# EAGLE design heatingHeader (EAGLE 6.3)
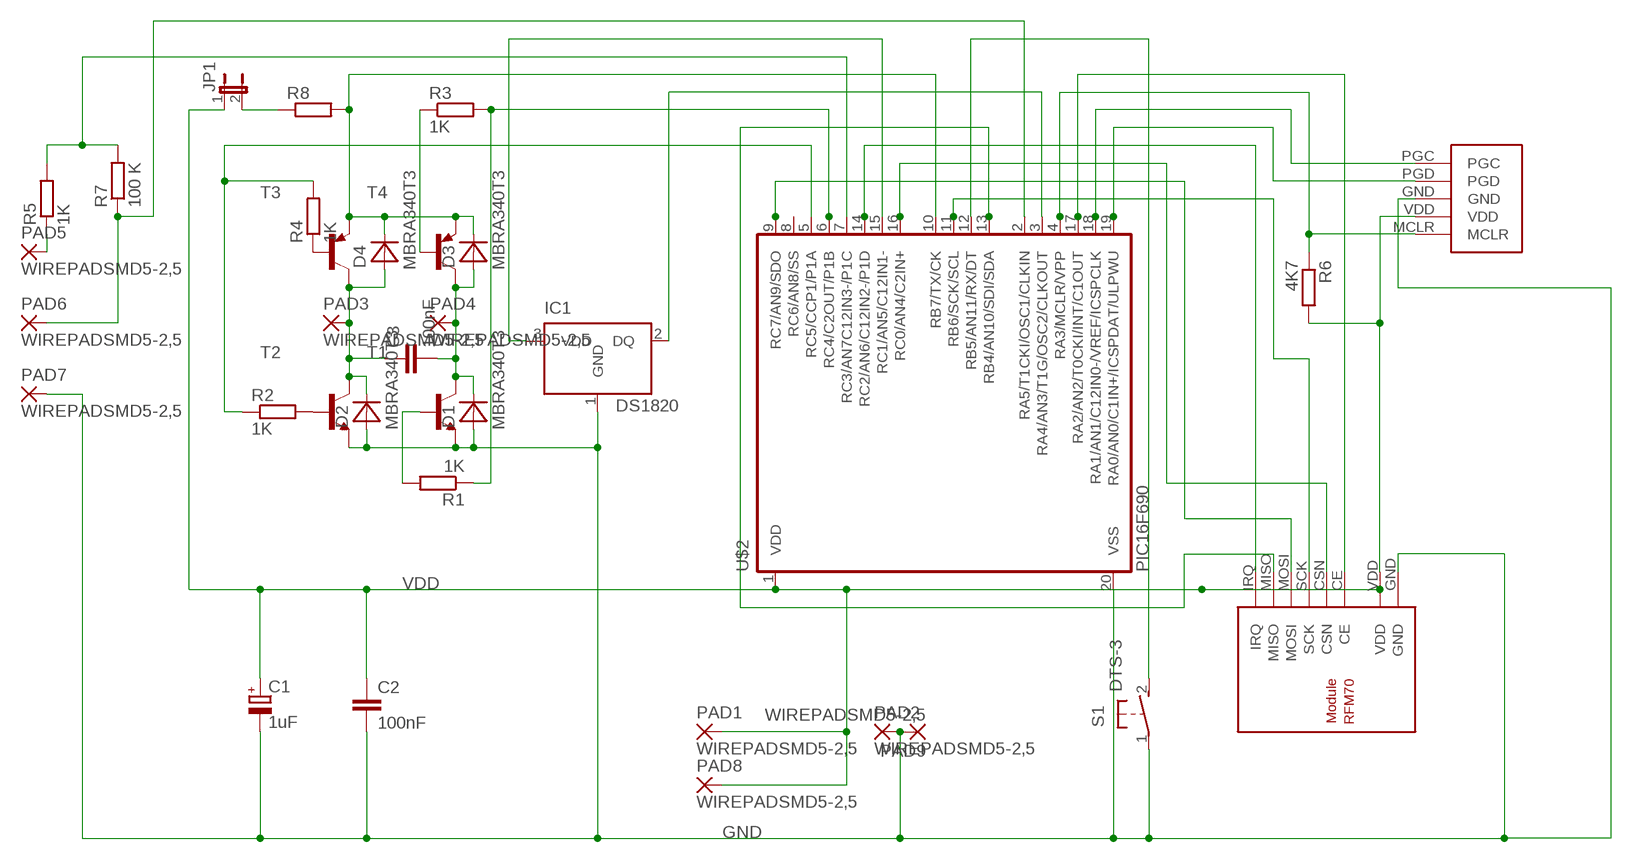
[diagram p0: schematic, sheet 1]

## Parts
C1  1uF  CPOL-EUSMCA  [SMC_A]
C2  100nF  C-EUC2012  [C2012]
C3  100nF  C-EUC2012  [C2012]
D1  MBRA340T3  [SMA]
D2  MBRA340T3  [SMA]
D3  MBRA340T3  [SMA]
D4  MBRA340T3  [SMA]
IC1  DS1820  [TO-92]
JP1  JP1E  [JP1]
PAD1  WIREPADSMD5-2,5  [5-2,5]
PAD2  WIREPADSMD5-2,5  [5-2,5]
PAD3  WIREPADSMD5-2,5  [5-2,5]
PAD4  WIREPADSMD5-2,5  [5-2,5]
PAD5  WIREPADSMD5-2,5  [5-2,5]
PAD6  WIREPADSMD5-2,5  [5-2,5]
PAD7  WIREPADSMD5-2,5  [5-2,5]
PAD8  WIREPADSMD5-2,5  [5-2,5]
PAD9  WIREPADSMD5-2,5  [5-2,5]
R1  1K  R-EU_R1206  [R1206]
R2  1K  R-EU_R1206  [R1206]
R3  1K  R-EU_R1206  [R1206]
R4  1K  R-EU_R1206  [R1206]
R5  1K  R-EU_R1206  [R1206]
R6  4K7  R-EU_R1206W  [R1206W]
R7  100 K  R-EU_R1206  [R1206]
R8  R-EU_R2512W  [R2512W]
S1  DTS-3  [DTS-3]
T1  BC817-40-NPN-SOT23-BEC  [SOT23-BEC]
T2  BC817-40-NPN-SOT23-BEC  [SOT23-BEC]
T3  BC807-16-PNP-SOT23-BEC  [SOT23-BEC]
T4  BC807-16-PNP-SOT23-BEC  [SOT23-BEC]
U$1  RFM70  [RFM70]
U$2  PIC16F690  [SSOP20]
U$3  PROGRAMMINGHEADERDIP  [PROGHEADER]

## Nets
GND: C1.- C2.2 D1.A D2.A IC1.1(GND) PAD2.1(P) PAD7.1(P) PAD9.1(P) S1.1 T1.E T2.E U$1.GND U$2.20(VSS) U$3.GND
N$1: IC1.2(DQ) U$2.3(RA4/AN3/T1G/OSC2/CLKOUT)
N$2: JP1.2 R8.1
N$3: IC1.3(VDD) U$2.15(RC1/AN5/C12IN1-)
N$4: PAD5.1(P) R5.1
N$6: U$1.MISO U$2.13(RB4/AN10/SDI/SDA)
N$7: C3.1 D2.C D4.A PAD3.1(P) T2.C T3.C
N$8: C3.2 D1.C D3.A PAD4.1(P) T1.C T4.C
N$9: PAD6.1(P) R7.1 U$2.2(RA5/T1CKI/OSC1/CLKIN)
N$10: S1.2 U$2.12(RB5/AN11/RX/DT)
N$12: R5.2 R7.2 U$2.7(RC3/AN7C12IN3-/P1C)
N$13: R2.2 T2.B
N$14: R4.1 T3.B
N$15: D3.C D4.C R8.2 T3.E T4.E U$2.10(RB7/TX/CK)
N$16: U$1.CE U$2.17(RA2/AN2/T0CKI/INT/C1OUT)
N$18: U$2.19(RA0/AN0/C1IN+/ICSPDAT/ULPWU) U$3.PGD
N$19: U$2.18(RA1/AN1/C12IN0-/VREF/ICSPCLK) U$3.PGC
N$20: U$1.CSN U$2.16(RC0/AN4/C2IN+)
N$21: U$1.IRQ U$2.14(RC2/AN6/C12IN2-/P1D)
N$22: U$1.SCK U$2.11(RB6/SCK/SCL)
N$23: U$1.MOSI U$2.9(RC7/AN9/SDO)
N$24: R1.2 T1.B
N$25: R6.1 U$2.4(RA3/MCLR/VPP) U$3.MCLR
N$27: R3.1 T4.B
N$30: R1.1 R3.2 U$2.6(RC4/C2OUT/P1B)
N$31: R2.1 R4.2 U$2.5(RC5/CCP1/P1A)
VDD: C1.+ C2.1 JP1.1 PAD1.1(P) PAD8.1(P) R6.2 U$1.VDD U$2.1(VDD) U$3.VDD
Unconnected: U$2.8(RC6/AN8/SS)

## Library data of the parts
C1 = resistor:CPOL-EU: POLARIZED CAPACITOR, European symbol
C2 C3 = resistor:C-EU: CAPACITOR, European symbol
D1-D4 = diode:MBRA340T3: Surface Mount Schottky Power Rectifier Source: http://www.onsemi.com/pub_link/Collateral/MBRA340T3-D.PDF
IC1 = ds1820:DS1820: DS1820 - 1-Wire Digital Thermometer
JP1 = jumper:JP1E: JUMPER
PAD1-PAD9 = wirepad:WIREPAD: Wire PAD connect wire on PCB
R1-R8 = resistor:R-EU_: RESISTOR, European symbol
S1 = switch-tact:DTS-3
T1 T2 = transistor:*-NPN-: NPN Transistror BF959 corrected 2008.03.06
T3 T4 = transistor:*-PNP-: PNP Transistror
U$1 = rfm70:RFM70: RFM70 2.4 Ghz Funkmodul Autor: Daniel Weber Website: http://projects.web4clans.com Email: daniel.weber@web4clans.com
U$2 = microchip:PIC16F690*: MICROCONTROLLER PIC16F690 18 I/O One 16-bit timer Two 8-bit timer Two comparators Precision internal oscillator-software selectable 8 MHz - 32 KHz SSP w/ I2C Compatible Address mask option EUSART LIN 2.0 Compatible ECCP+ w/ PWM Steering 12 A/D Channels ULPW Enhanced Low Power Timer 1 Timer 1 Gate Synch Latch 4k Program Flash memory 256 bytes SRAM 256 bytes EEPROM
U$3 = rfm70:PROGRAMMINGHEADER

## Board
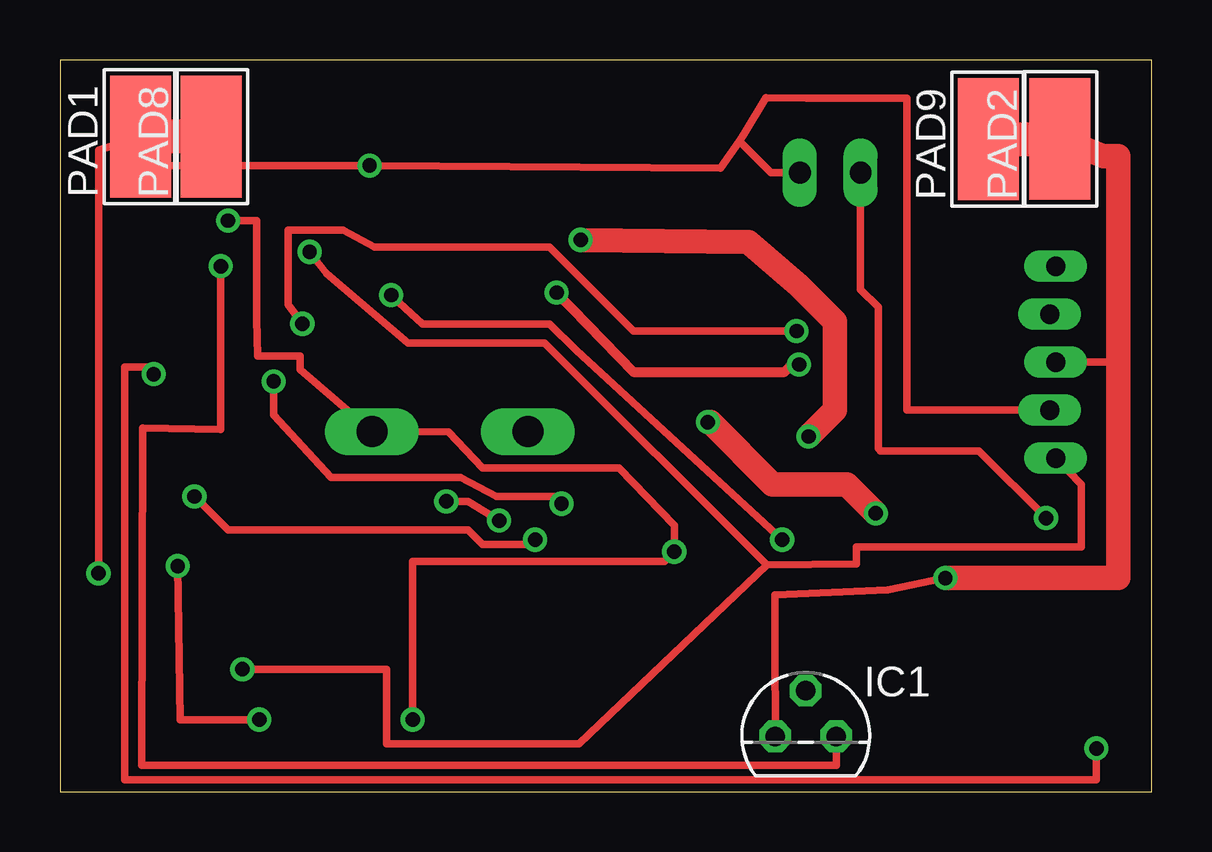
[diagram p1: board, top side]
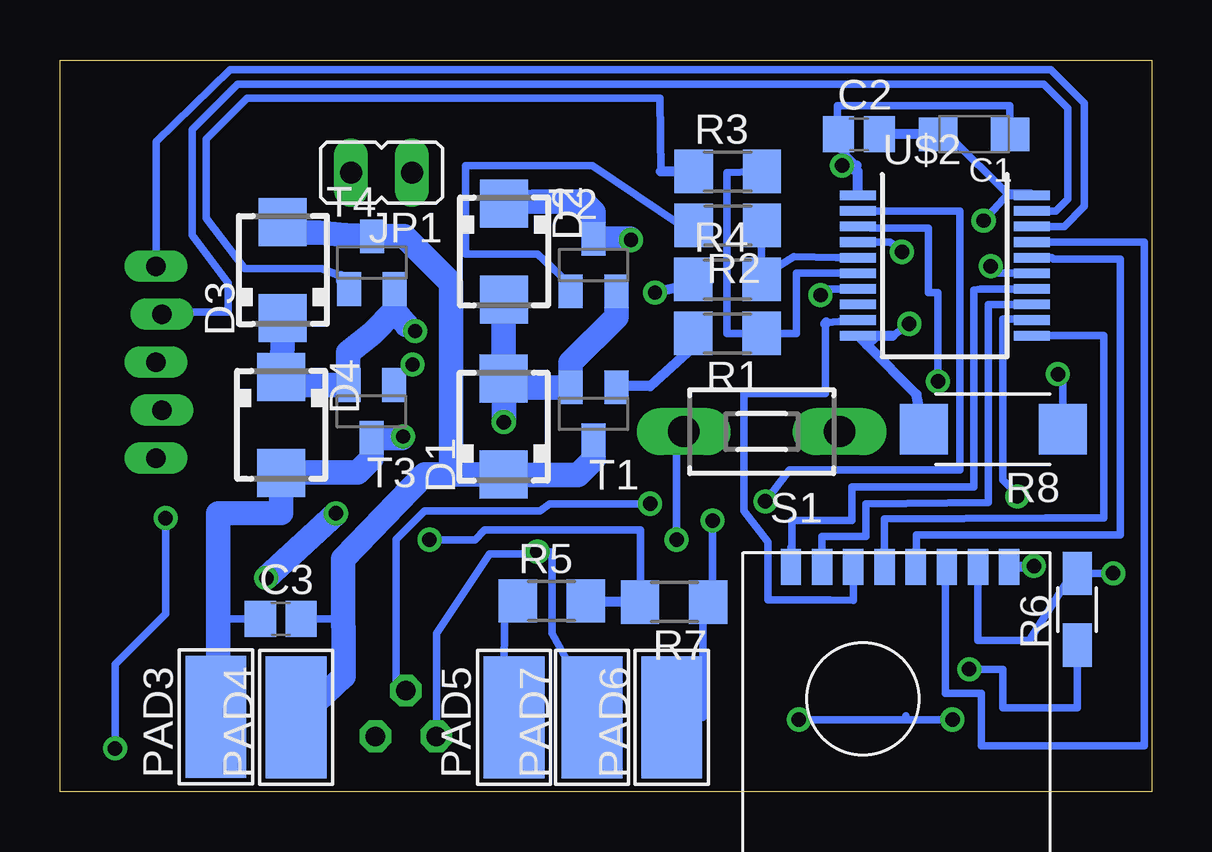
[diagram p2: board, bottom side, seen from below]

Size 45.5 x 30.5 mm. Coordinates in mm from the lower left corner, seen from the top.
Outline: 0,0 45.5,0 45.5,30.5 0,30.48 0,0
Copper layers (1*16): Top 0.035mm / dielectric 1.5mm / Bottom 0.035mm
Design rules "default *": minimum track width 10mil, minimum drill 24mil, track to track 8mil, track to pad 8mil, pad to pad 8mil, via to via 8mil, smd to smd 8mil, copper to edge 5mil, drill to drill 8mil, minimum pad ring 10mil, minimum via ring 8mil, stop-mask expansion 4mil, vias tented up to drill 0mil, thermal gap 10mil

### Footprints (pad centres in the part's own frame; a part is rotated, then mirrored left to right if it is on the bottom)
SMC_A = smd 1.6 x 1.4: + -1.5,0; - 1.5,0
C2012 = smd 1.3 x 1.5: 1 -0.85,0; 2 0.85,0
SMA = smd 2 x 2: A 2,0; C -2,0
TO-92 = drill 0.813 pad 1.27 octagon: 1 -1.27,0; 2 0,1.905; 3 1.27,0
JP1 = drill 0.914 long: 1 0,-1.27; 2 0,1.27
5-2,5 = smd 2.54 x 5.08: 1 0,0
R1206 = smd 1.6 x 1.803: 1 -1.422,0; 2 1.422,0
R1206W = smd 1.8 x 1.2: 1 -1.499,0; 2 1.499,0
R2512W = smd 2 x 2.1: 1 -2.896,0; 2 2.896,0
DTS-3 = drill 1.3 long: 1 -3.25,0; 2 3.25,0
SOT23-BEC = smd 1 x 1.4: B -0.95,-1.1; C 0,1.1; E 0.95,-1.1
RFM70 = smd 0.85 x 1.5: CE 2.5,-14.3; CSN 3.8,-14.3; GND -0.1,-14.3; IRQ 9,-14.3; MISO 7.7,-14.3; MOSI 6.4,-14.3; SCK 5.1,-14.3; VDD 1.2,-14.3
SSOP20 = smd 0.4 x 1.5: 1 -2.925,-3.625; 2 -2.275,-3.625; 3 -1.625,-3.625; 4 -0.975,-3.625; 5 -0.325,-3.625; 6 0.325,-3.625; 7 0.975,-3.625; 8 1.625,-3.625; 9 2.275,-3.625; 10 2.925,-3.625; 11 2.925,3.625; 12 2.275,3.625; 13 1.625,3.625; 14 0.975,3.625; 15 0.325,3.625; 16 -0.325,3.625; 17 -0.975,3.625; 18 -1.625,3.625; 19 -2.275,3.625; 20 -2.925,3.625
PROGHEADER = drill 0.8 long: GND 0,0; MCLR -4,0; PGC 4,0; PGD 2,0.25; VDD -2,0.25

### Placement (x,y rotation side)
C1  7.4,27.4 180 bottom
C2  12.2,27.4 0 bottom
C3  36.3,7.2 0 bottom
D1  27.01,15.21 90 bottom
D2  26.99,22.52 270 bottom
D3  36.21,21.75 90 bottom
D4  36.28,15.29 270 bottom
IC1  31.08,2.3 0 top
JP1  32.1,25.8 90 bottom
PAD1  3.36,27.31 0 top
PAD2  41.68,27.21 0 top
PAD3  39,3.11 0 bottom
PAD4  35.66,3.1 0 bottom
PAD5  26.58,3.1 0 bottom
PAD6  20,3.1 0 bottom
PAD7  23.32,3.1 0 bottom
PAD8  6.3,27.3 0 top
PAD9  38.7,27.2 0 top
R1  17.68,19.1 180 bottom
R2  17.66,23.6 180 bottom
R3  17.66,25.85 0 bottom
R4  17.68,21.35 0 bottom
R5  25,7.95 0 bottom
R6  3.1,7.6 90 bottom
R7  19.9,7.9 180 bottom
R8  6.6,15.1 180 bottom
S1  16.25,15.01 180 bottom
T1  23.26,15.75 180 bottom
T2  23.26,21.95 0 bottom
T3  32.52,15.85 180 bottom
T4  32.5,22.05 0 bottom
U$1  6.03,-4.94 180 bottom
U$2  8.62,21.93 270 bottom
U$3  41.5,17.9 90 top

### Tracks (layer width: path | path; a pad name or v marks a point on that pad's centre or on a via)
GND  (via drill 0.6)
  Top 0.305: v7,23.8 8.2,23.8 8.2,19.7 8.24,18.16 10,18.16 10,17.6 S1.1 16.2,15 17.6,13.5 23.3,13.5 25.6,11.1 v25.6,10 25.2,9.6 14.7,9.6 v14.7,3 | v4.9,9.4 5,3 v8.3,3 | v36.9,8.9 34.5,8.4 29.8,8.2 29.8,6.11 IC1.1 | U$3.GND 44.1,17.9
  Top 1.016: v34,11.6 32.8,12.8 29.7,12.8 27.1,15.4 v27,15.4 | v36.9,8.9 44.1,8.9 44.1,17.9 44.1,26.5 43.48,26.5 PAD2.1
  Top 1.422: PAD9.1 PAD2.1
  Bottom 0.305: 23.3,3.12 23.2,3 | 23.6,3.9 24.1,3.9 | 23.8,3 24.1,3.9 | 24.1,3.9 24.1,3.5 23.9,3.9 23.9,3.2 22.9,3.9 22.9,4.4 23.6,4.4 23.6,4.1 25,6.6 25,10 25.2,10 | 25.2,10 25.6,9.9 27.6,9.9 29.81,6.59 IC1.1 | v7,23.8 6,24.9 8.4,27.3 | 25.2,10 v25.6,10 | 5.2,9.36 v4.9,9.4 | v8.3,3 10.2,3 | 10.2,3 v14.7,3 | 10.25,3.15 10.2,3
  Bottom 0.406: 6,24.9 5.04,24.9 U$2.20 | 8.4,27.3 C1.- C2.2 | 25.6,9.7 v25.6,10 | 5.2,9.36 U$1.GND
  Bottom 0.61: PAD7.1 23.3,3.12 | 23.2,3 23.6,3.9
  Bottom 1.016: D2.A 27.01,20.5 D1.A 26.65,16.85 T1.E | T2.E 22.31,19.79 24.21,17.89 T1.E | T1.E 27,16.85 v27,15.4 | v34,11.6 v36.9,8.9
N$1  (via drill 0.6)
  Top 0.305: v8.9,17.1 8.9,15.7 11.3,13.1 16.7,13.1 18.2,12.3 20.9,12.3 v20.9,12
  Bottom 0.305: IC1.2 31.5,4 31.5,5.1 31.48,10.52 30.3,11.7 25.5,11.7 25.1,12 v20.9,12 | v8.9,17.1 8.9,20.8 9.3,20.8 9.3,23.5 11.7,23.5 U$2.3
N$2  (via drill 0.6)
  Top 0.305: JP1.2 33.37,20.93 34.1,20.2 34.1,14.3 34.2,14.2 38.3,14.2 v41.1,11.4 | v43.2,1.8 43.2,0.5 2.7,0.5 2.7,17.7 3.9,17.7 v3.9,17.4
  Bottom 0.305: v41.1,11.4 41.1,7.4 43.2,5.3 v43.2,1.8 | v3.9,17.4 3.7,17.4 R8.1
N$3  (via drill 0.6)
  Top 0.305: IC1.3 32.35,1.1 3.4,1.1 3.45,15.15 6.7,15.1 v6.7,21.9
  Bottom 0.305: U$2.15 6.41,21.61 v6.7,21.9
N$4
  Bottom 0.305: 26.8,3.48 27,5.4 26.95,7.95 R5.1
  Bottom 0.406: 26.8,3.48 PAD5.1
N$6
  Bottom 0.305: U$1.MISO 13.73,10.63 11.9,10.63 11.9,12 6.8,12.06 6.8,19.6 6.79,20.3 U$2.13
N$7  (via drill 0.6)
  Top 1.016: v31.2,14.8 32.3,15.9 32.3,19.6 30.8,21.1 28.7,22.9 v21.7,23
  Bottom 0.305: C3.1 38.6,7.2 38.9,6.9
  Bottom 1.016: PAD3.1 38.9,5.01 38.9,6.9 38.9,11.6 36.28,11.62 D4.A 33.1,13.3 32.52,13.88 T3.C 31.25,14.75 v31.2,14.8 | D2.C 25.77,24.6 23.7,24.6 23.26,24.16 T2.C 21.75,23.05 v21.7,23
N$8
  Bottom 0.305: C3.2 34.16,7.2 33.68,6.82
  Bottom 1.016: 36,2.54 35.92,2.67 | 35.92,2.67 PAD4.1 | D3.A 35.76,23.3 34.7,23.3 33.6,23.2 T4.C 31.15,23.15 29.2,21.2 29.2,13.22 30.29,13.21 | T1.C 23.26,13.84 23.9,13.2 D1.C 30.29,13.21 | 30.29,13.21 33.7,9.7 33.7,6.92 33.68,6.82 33.68,4.81 35.92,2.67
N$9  (via drill 0.6)
  Top 0.305: v16.1,12.1 17,12.1 v18.3,11.3
  Bottom 0.305: 18.7,7.9 18.7,3.1 PAD6.1 | U$2.2 8.01,24.2 8,24.2 8,13.4 15.1,13.4 v16.1,12.1 | v18.3,11.3 18.3,7.98 R7.1
  Bottom 0.406: R7.1 18.7,7.9
N$10  (via drill 0.6)
  Top 0.305: v19.8,10.5 19.7,10.5 19.5,10.3 17.6,10.3 17,10.9 7,10.9 v5.6,12.3
  Bottom 0.305: S1.2 19.8,15.01 v19.8,10.5 | v5.6,12.3 5.6,12.4 6.2,13 6.2,19.7 5.04,19.7 U$2.12
N$12  (via drill 0.6)
  Top 0.305: v13.8,20.7 13.9,20.6 15.1,19.5 20.4,19.5 21.5,18.4 v30.1,10.5
  Bottom 0.305: 21.3,8 21.22,7.92 R7.2 21.3,7.98 21.3,10.9 27.8,10.9 28.2,10.5 v30.1,10.5 | U$2.7 13.54,20.95 v13.8,20.7
  Bottom 0.406: R7.2 23.58,7.9 R5.2
N$13
  Bottom 0.305: 19.6,23.6 23.3,26.1 28.6,26.1 28.6,22.4 25.6,22.4 24.4,21.3
  Bottom 0.406: R2.2 19.6,23.6 | 24.4,21.3 24.4,21.04 T2.B
N$14  (via drill 0.6)
  Top 0.406: v20.7,20.8 23.9,17.5 30.2,17.5 30.7,18 v30.8,17.8
  Bottom 0.406: R4.1 18.45,21.3 v20.7,20.8 | v30.8,17.8 30.7,18 31.57,17.13 T3.B
N$15  (via drill 0.6)
  Top 0.305: v30.7,19.2 23.9,19.2 20.4,22.7 13.1,22.7 11.8,23.4 9.5,23.4 9.5,20.3 v10.1,19.5
  Bottom 0.305: 31.55,20.05 v30.7,19.2 | v10.1,19.5 10.8,19
  Bottom 0.406: R8.2 9.8,16.56 11.87,18.63 | 11.87,18.63 U$2.10 | 10.8,19 11.5,19 11.87,18.63
  Bottom 1.016: D3.C 36.18,19.48 D4.C 35.94,16.95 33.5,16.95 | T3.E 33.5,16.95 | T4.E 31.55,20.05 | 31.55,20.05 31.05,19.45 | 33.5,16.95 33.5,18.3 32.5,19.1 31.55,20.05
N$16
  Bottom 0.305: U$1.CE 8.6,9.39 8.6,4.1 7.1,4.1 7.1,1.9 0.3,1.9 0.3,22.9 3.6,22.91 U$2.17
N$17  (via drill 0.6)
  other vias: 13.8,20.7
N$18
  Bottom 0.305: 40.48,20 38.5,20 38.5,21.2 40,23.2 40,27.6 38.1,29.5 4.5,29.5 3.5,28.5 3.5,24.7 4,24.2 U$2.19
  Bottom 0.406: 40.58,19.8 U$3.PGD 40.48,20
N$19
  Bottom 0.305: 41.6,21.54 41.6,22 | 41.5,21.8 41.5,27.1 38.4,30.1 4.2,30.1 2.8,28.7 2.8,24.4 3.65,23.55 U$2.18
  Bottom 0.406: U$3.PGC 41.5,21.8 41.6,22
N$20
  Bottom 0.305: U$1.CSN 9.8,10.69 1.3,10.7 1.3,22.2 4.1,22.2 4.16,22.25 U$2.16
N$21
  Bottom 0.305: U$1.IRQ 15.03,10.17 15,10.17 15,11.3 12.5,11.3 12.5,12.7 7.4,12.7 7.4,20.9 7.14,20.95 U$2.14
N$22
  Bottom 0.305: U$1.SCK 11.13,11.37 4.4,11.4 2,11.4 2,19 U$2.11
N$23
  Bottom 0.305: U$1.MOSI 12.43,7.97 13.4,8 16,8 16,10.4 17,11.7 17,16.6 13.6,16.6 13.6,19.5 | 13.55,19.55 U$2.9
  Bottom 0.406: 13.55,19.55 13.6,19.5
N$24
  Bottom 0.406: R1.2 18.5,19.1 20.9,16.9 22.26,16.9 T1.B
N$25  (via drill 0.6)
  Top 0.305: 29.47,9.45 33.2,9.5 33.2,10.2 42.56,10.2 42.56,12.8 U$3.MCLR | 29.47,9.45 20.2,18.7 14.5,18.7 11.1,21.6 v10.4,22.5 | 29.47,9.45 21.63,2 13.6,2 13.6,5.1 v7.6,5.1
  Bottom 0.305: v10.4,22.5 10.6,22.7 10.9,22.9 10.94,22.9 U$2.4 | R6.1 3.1,3.5 6.2,3.5 6.2,5.1 v7.6,5.1
N$27
  Bottom 0.305: 20.45,25.85 20.5,28.9 37.7,28.9 39.4,27.2 39.4,23.9 37.8,21.8 34.6,21.8 33.8,21.5
  Bottom 0.406: R3.1 20.45,25.85 | 33.8,21.5 33.8,21.3 T4.B
N$30
  Bottom 0.305: U$2.6 14.79,21.61 14.8,21.6 14.8,19.1 R1.1 17.7,19.1 17.7,25.8 16.55,25.85 R3.2
N$31
  Bottom 0.305: U$2.5 13.14,22.25 14.9,22.3 16.21,21.5 R4.2 16.26,23.38 R2.1
VDD  (via drill 0.6)
  Top 0.305: 4,26.1 v12.9,26.1 27.53,26 28.31,27.12 | 28.31,27.12 28.5,27.4 29.43,28.93 31.1,28.9 35.3,28.9 35.3,15.9 U$3.VDD | v1.6,9.1 1.6,26.75 PAD1.1 | JP1.1 29.63,25.8 28.31,27.12
  Top 0.406: PAD1.1 2.79,27.21 4,26.1
  Top 1.422: PAD8.1 PAD1.1
  Bottom 0.305: 12.3,26.1 13.1,26.9 | C1.+ 5.9,28.6 13.1,28.6 13.1,27.45 | v1.6,9.1 R6.2 3.3,9.1 5.1,6.3 7.23,6.3 U$1.VDD
  Bottom 0.406: U$2.1 12.24,25.84 v12.9,26.1 12.3,26.1 | 13.1,26.9 13.1,27.65 C2.1 13.1,27.45